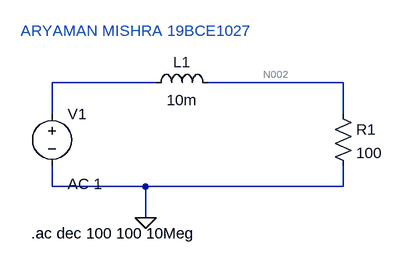
[diagram p0: schematic lab_1_task_4.asc]
lab_1_task_4.asc, the LTspice schematic file:
Version 4
SHEET 1 880 680
WIRE 144 128 -16 128
WIRE 432 128 224 128
WIRE -16 176 -16 128
WIRE 432 176 432 128
WIRE -16 288 -16 256
WIRE 128 288 -16 288
WIRE 432 288 432 256
WIRE 432 288 128 288
WIRE 128 336 128 288
FLAG 128 336 0
SYMBOL voltage -16 160 R0
WINDOW 123 24 124 Left 2
WINDOW 39 0 0 Left 0
SYMATTR Value2 AC 1
SYMATTR InstName V1
SYMATTR Value ""
SYMBOL ind 128 144 R270
WINDOW 0 32 56 VTop 2
WINDOW 3 5 56 VBottom 2
SYMATTR InstName L1
SYMATTR Value 10m
SYMBOL res 416 160 R0
SYMATTR InstName R1
SYMATTR Value 100
TEXT -48 360 Left 2 !.ac dec 100 100 10Meg
TEXT -64 48 Left 2 ;ARYAMAN MISHRA 19BCE1027

The netlist it stands for:
* lab_1_task_4.asc
V1 N001 0 AC 1
L1 N001 N002 10m
R1 N002 0 100
.ac dec 100 100 10Meg
* ARYAMAN MISHRA 19BCE1027
.backanno
.end

* Results of the author's LTspice run, read from the files saved beside the schematic
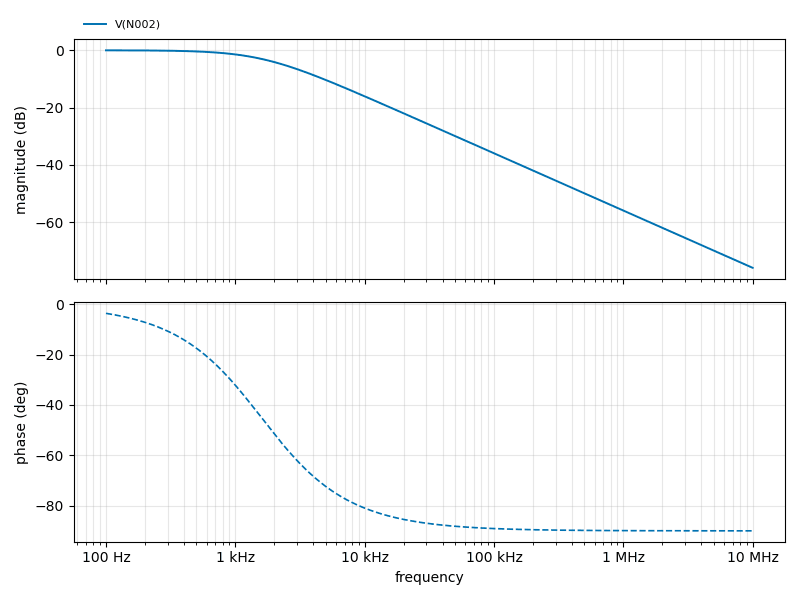
[diagram p1: AC Analysis of lab_1_task_4.asc, plotted from the saved traces]
* AC Analysis, 1 run:
*   V(N002): -0.02 dB at 100 Hz, -75.96 dB at 10 MHz, peak -0.02 dB at 100 Hz, 3 dB below the peak at 1.598 kHz